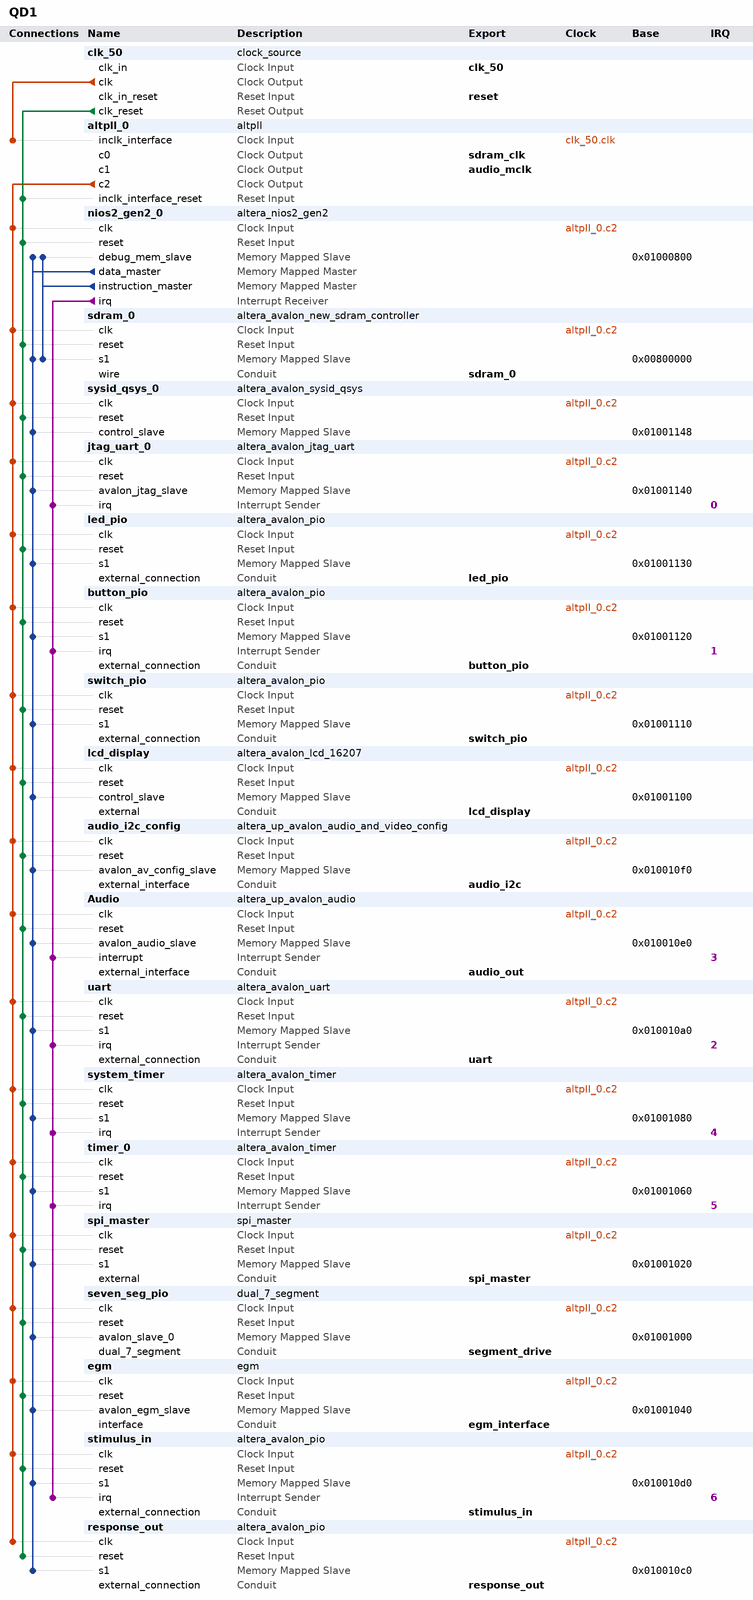
[diagram p0: system contents]
# Platform Designer (Qsys) system QD1, MAX 10 10M08SAE144C8G
# Parameters at their usual value, and those the tool derives, are not listed.
package require -exact qsys 15.1
create_system QD1
set_project_property DEVICE_FAMILY {MAX 10}
set_project_property DEVICE 10M08SAE144C8G

add_instance clk_50 clock_source 15.1
set_instance_parameter_value clk_50 clockFrequency 50000000

add_instance altpll_0 altpll 15.1
set_instance_parameter_value altpll_0 CLK0_DIVIDE_BY 1
set_instance_parameter_value altpll_0 CLK0_MULTIPLY_BY 1
set_instance_parameter_value altpll_0 CLK0_PHASE_SHIFT -3000
set_instance_parameter_value altpll_0 CLK1_DIVIDE_BY 1250
set_instance_parameter_value altpll_0 CLK1_DUTY_CYCLE 50
set_instance_parameter_value altpll_0 CLK1_MULTIPLY_BY 307
set_instance_parameter_value altpll_0 CLK1_PHASE_SHIFT 0
set_instance_parameter_value altpll_0 CLK2_DIVIDE_BY 1
set_instance_parameter_value altpll_0 CLK2_DUTY_CYCLE 50
set_instance_parameter_value altpll_0 CLK2_MULTIPLY_BY 1
set_instance_parameter_value altpll_0 CLK2_PHASE_SHIFT 0
set_instance_parameter_value altpll_0 INCLK0_INPUT_FREQUENCY 20000
set_instance_parameter_value altpll_0 PORT_ARESET PORT_USED
set_instance_parameter_value altpll_0 PORT_LOCKED PORT_UNUSED
set_instance_parameter_value altpll_0 PORT_clk1 PORT_USED
set_instance_parameter_value altpll_0 PORT_clk2 PORT_USED
set_instance_parameter_value altpll_0 PORT_clk3 PORT_UNUSED

add_instance nios2_gen2_0 altera_nios2_gen2 15.1
set_instance_parameter_value nios2_gen2_0 dcache_size 2048
set_instance_parameter_value nios2_gen2_0 exceptionSlave sdram_0.s1
set_instance_parameter_value nios2_gen2_0 icache_size 4096
set_instance_parameter_value nios2_gen2_0 impl Fast
set_instance_parameter_value nios2_gen2_0 resetSlave sdram_0.s1

add_instance sdram_0 altera_avalon_new_sdram_controller 15.1
set_instance_parameter_value sdram_0 TAC 5.5
set_instance_parameter_value sdram_0 TRCD 20.0
set_instance_parameter_value sdram_0 TRP 20.0
set_instance_parameter_value sdram_0 casLatency 3
set_instance_parameter_value sdram_0 columnWidth 8
set_instance_parameter_value sdram_0 dataWidth 16
set_instance_parameter_value sdram_0 generateSimulationModel false
set_instance_parameter_value sdram_0 model single_Micron_MT48LC4M32B2_7_chip
set_instance_parameter_value sdram_0 numberOfBanks 4
set_instance_parameter_value sdram_0 numberOfChipSelects 1
set_instance_parameter_value sdram_0 powerUpDelay 100.0
set_instance_parameter_value sdram_0 refreshPeriod 15.625
set_instance_parameter_value sdram_0 rowWidth 12

add_instance sysid_qsys_0 altera_avalon_sysid_qsys 15.1
set_instance_parameter_value sysid_qsys_0 id 0

add_instance jtag_uart_0 altera_avalon_jtag_uart 15.1
set_instance_parameter_value jtag_uart_0 simInteractiveOptions NO_INTERACTIVE_WINDOWS

add_instance led_pio altera_avalon_pio 15.1
set_instance_parameter_value led_pio direction Output
set_instance_parameter_value led_pio width 4

add_instance button_pio altera_avalon_pio 15.1
set_instance_parameter_value button_pio captureEdge true
set_instance_parameter_value button_pio direction Input
set_instance_parameter_value button_pio edgeType ANY
set_instance_parameter_value button_pio generateIRQ true
set_instance_parameter_value button_pio irqType EDGE
set_instance_parameter_value button_pio width 4

add_instance switch_pio altera_avalon_pio 15.1
set_instance_parameter_value switch_pio direction Input
set_instance_parameter_value switch_pio width 8

add_instance lcd_display altera_avalon_lcd_16207 15.1

add_instance audio_i2c_config altera_up_avalon_audio_and_video_config 15.1
set_instance_parameter_value audio_i2c_config audio_in {Line In to ADC}
set_instance_parameter_value audio_i2c_config bit_length 16
set_instance_parameter_value audio_i2c_config board DE1-SoC
set_instance_parameter_value audio_i2c_config line_in_bypass false
set_instance_parameter_value audio_i2c_config sampling_rate {48 kHz}

add_instance Audio altera_up_avalon_audio 15.1
set_instance_parameter_value Audio audio_in true
set_instance_parameter_value Audio avalon_bus_type {Memory Mapped}
set_instance_parameter_value Audio dw 16

add_instance uart altera_avalon_uart 15.1
set_instance_parameter_value uart baud 115200
set_instance_parameter_value uart dataBits 8
set_instance_parameter_value uart fixedBaud true
set_instance_parameter_value uart parity NONE
set_instance_parameter_value uart stopBits 1

add_instance system_timer altera_avalon_timer 15.1
set_instance_parameter_value system_timer period 1
set_instance_parameter_value system_timer periodUnits MSEC

add_instance timer_0 altera_avalon_timer 15.1
set_instance_parameter_value timer_0 period 1
set_instance_parameter_value timer_0 periodUnits MSEC

add_instance spi_master spi_master 1.3

add_instance seven_seg_pio dual_7_segment 1.0

add_instance egm egm 2.0

add_instance stimulus_in altera_avalon_pio 15.1
set_instance_parameter_value stimulus_in captureEdge true
set_instance_parameter_value stimulus_in direction Input
set_instance_parameter_value stimulus_in generateIRQ true
set_instance_parameter_value stimulus_in irqType EDGE
set_instance_parameter_value stimulus_in width 1

add_instance response_out altera_avalon_pio 15.1
set_instance_parameter_value response_out direction Output
set_instance_parameter_value response_out width 1

# connections
add_connection altpll_0.c2 Audio.clk clock
add_connection altpll_0.c2 audio_i2c_config.clk clock
add_connection altpll_0.c2 button_pio.clk clock
add_connection altpll_0.c2 egm.clk clock
add_connection altpll_0.c2 jtag_uart_0.clk clock
add_connection altpll_0.c2 lcd_display.clk clock
add_connection altpll_0.c2 led_pio.clk clock
add_connection altpll_0.c2 nios2_gen2_0.clk clock
add_connection altpll_0.c2 response_out.clk clock
add_connection altpll_0.c2 sdram_0.clk clock
add_connection altpll_0.c2 seven_seg_pio.clk clock
add_connection altpll_0.c2 spi_master.clk clock
add_connection altpll_0.c2 stimulus_in.clk clock
add_connection altpll_0.c2 switch_pio.clk clock
add_connection altpll_0.c2 sysid_qsys_0.clk clock
add_connection altpll_0.c2 system_timer.clk clock
add_connection altpll_0.c2 timer_0.clk clock
add_connection altpll_0.c2 uart.clk clock
add_connection clk_50.clk altpll_0.inclk_interface clock
add_connection clk_50.clk_reset altpll_0.inclk_interface_reset reset
add_connection clk_50.clk_reset Audio.reset reset
add_connection clk_50.clk_reset audio_i2c_config.reset reset
add_connection clk_50.clk_reset button_pio.reset reset
add_connection clk_50.clk_reset egm.reset reset
add_connection clk_50.clk_reset jtag_uart_0.reset reset
add_connection clk_50.clk_reset lcd_display.reset reset
add_connection clk_50.clk_reset led_pio.reset reset
add_connection clk_50.clk_reset nios2_gen2_0.reset reset
add_connection clk_50.clk_reset response_out.reset reset
add_connection clk_50.clk_reset sdram_0.reset reset
add_connection clk_50.clk_reset seven_seg_pio.reset reset
add_connection clk_50.clk_reset spi_master.reset reset
add_connection clk_50.clk_reset stimulus_in.reset reset
add_connection clk_50.clk_reset switch_pio.reset reset
add_connection clk_50.clk_reset sysid_qsys_0.reset reset
add_connection clk_50.clk_reset system_timer.reset reset
add_connection clk_50.clk_reset timer_0.reset reset
add_connection clk_50.clk_reset uart.reset reset
add_connection nios2_gen2_0.data_master Audio.avalon_audio_slave avalon
set_connection_parameter_value nios2_gen2_0.data_master/Audio.avalon_audio_slave baseAddress 0x010010e0
add_connection nios2_gen2_0.data_master audio_i2c_config.avalon_av_config_slave avalon
set_connection_parameter_value nios2_gen2_0.data_master/audio_i2c_config.avalon_av_config_slave baseAddress 0x010010f0
add_connection nios2_gen2_0.data_master button_pio.s1 avalon
set_connection_parameter_value nios2_gen2_0.data_master/button_pio.s1 baseAddress 0x01001120
add_connection nios2_gen2_0.data_master egm.avalon_egm_slave avalon
set_connection_parameter_value nios2_gen2_0.data_master/egm.avalon_egm_slave baseAddress 0x01001040
add_connection nios2_gen2_0.data_master jtag_uart_0.avalon_jtag_slave avalon
set_connection_parameter_value nios2_gen2_0.data_master/jtag_uart_0.avalon_jtag_slave baseAddress 0x01001140
add_connection nios2_gen2_0.data_master lcd_display.control_slave avalon
set_connection_parameter_value nios2_gen2_0.data_master/lcd_display.control_slave baseAddress 0x01001100
add_connection nios2_gen2_0.data_master led_pio.s1 avalon
set_connection_parameter_value nios2_gen2_0.data_master/led_pio.s1 baseAddress 0x01001130
add_connection nios2_gen2_0.data_master nios2_gen2_0.debug_mem_slave avalon
set_connection_parameter_value nios2_gen2_0.data_master/nios2_gen2_0.debug_mem_slave baseAddress 0x01000800
add_connection nios2_gen2_0.data_master response_out.s1 avalon
set_connection_parameter_value nios2_gen2_0.data_master/response_out.s1 baseAddress 0x010010c0
add_connection nios2_gen2_0.data_master sdram_0.s1 avalon
set_connection_parameter_value nios2_gen2_0.data_master/sdram_0.s1 baseAddress 0x00800000
add_connection nios2_gen2_0.data_master seven_seg_pio.avalon_slave_0 avalon
set_connection_parameter_value nios2_gen2_0.data_master/seven_seg_pio.avalon_slave_0 baseAddress 0x01001000
add_connection nios2_gen2_0.data_master spi_master.s1 avalon
set_connection_parameter_value nios2_gen2_0.data_master/spi_master.s1 baseAddress 0x01001020
add_connection nios2_gen2_0.data_master stimulus_in.s1 avalon
set_connection_parameter_value nios2_gen2_0.data_master/stimulus_in.s1 baseAddress 0x010010d0
add_connection nios2_gen2_0.data_master switch_pio.s1 avalon
set_connection_parameter_value nios2_gen2_0.data_master/switch_pio.s1 baseAddress 0x01001110
add_connection nios2_gen2_0.data_master sysid_qsys_0.control_slave avalon
set_connection_parameter_value nios2_gen2_0.data_master/sysid_qsys_0.control_slave baseAddress 0x01001148
add_connection nios2_gen2_0.data_master system_timer.s1 avalon
set_connection_parameter_value nios2_gen2_0.data_master/system_timer.s1 baseAddress 0x01001080
add_connection nios2_gen2_0.data_master timer_0.s1 avalon
set_connection_parameter_value nios2_gen2_0.data_master/timer_0.s1 baseAddress 0x01001060
add_connection nios2_gen2_0.data_master uart.s1 avalon
set_connection_parameter_value nios2_gen2_0.data_master/uart.s1 baseAddress 0x010010a0
add_connection nios2_gen2_0.instruction_master nios2_gen2_0.debug_mem_slave avalon
set_connection_parameter_value nios2_gen2_0.instruction_master/nios2_gen2_0.debug_mem_slave baseAddress 0x01000800
add_connection nios2_gen2_0.instruction_master sdram_0.s1 avalon
set_connection_parameter_value nios2_gen2_0.instruction_master/sdram_0.s1 baseAddress 0x00800000
add_connection nios2_gen2_0.irq Audio.interrupt interrupt
set_connection_parameter_value nios2_gen2_0.irq/Audio.interrupt irqNumber 3
add_connection nios2_gen2_0.irq button_pio.irq interrupt
set_connection_parameter_value nios2_gen2_0.irq/button_pio.irq irqNumber 1
add_connection nios2_gen2_0.irq jtag_uart_0.irq interrupt
set_connection_parameter_value nios2_gen2_0.irq/jtag_uart_0.irq irqNumber 0
add_connection nios2_gen2_0.irq stimulus_in.irq interrupt
set_connection_parameter_value nios2_gen2_0.irq/stimulus_in.irq irqNumber 6
add_connection nios2_gen2_0.irq system_timer.irq interrupt
set_connection_parameter_value nios2_gen2_0.irq/system_timer.irq irqNumber 4
add_connection nios2_gen2_0.irq timer_0.irq interrupt
set_connection_parameter_value nios2_gen2_0.irq/timer_0.irq irqNumber 5
add_connection nios2_gen2_0.irq uart.irq interrupt
set_connection_parameter_value nios2_gen2_0.irq/uart.irq irqNumber 2

# exported interfaces
add_interface audio_i2c conduit end
set_interface_property audio_i2c EXPORT_OF audio_i2c_config.external_interface
add_interface audio_mclk clock source
set_interface_property audio_mclk EXPORT_OF altpll_0.c1
add_interface audio_out conduit end
set_interface_property audio_out EXPORT_OF Audio.external_interface
add_interface button_pio conduit end
set_interface_property button_pio EXPORT_OF button_pio.external_connection
add_interface clk_50 clock sink
set_interface_property clk_50 EXPORT_OF clk_50.clk_in
add_interface egm_interface conduit end
set_interface_property egm_interface EXPORT_OF egm.interface
add_interface lcd_display conduit end
set_interface_property lcd_display EXPORT_OF lcd_display.external
add_interface led_pio conduit end
set_interface_property led_pio EXPORT_OF led_pio.external_connection
add_interface reset reset sink
set_interface_property reset EXPORT_OF clk_50.clk_in_reset
add_interface response_out conduit end
set_interface_property response_out EXPORT_OF response_out.external_connection
add_interface sdram_0 conduit end
set_interface_property sdram_0 EXPORT_OF sdram_0.wire
add_interface sdram_clk clock source
set_interface_property sdram_clk EXPORT_OF altpll_0.c0
add_interface segment_drive conduit end
set_interface_property segment_drive EXPORT_OF seven_seg_pio.dual_7_segment
add_interface spi_master conduit end
set_interface_property spi_master EXPORT_OF spi_master.external
add_interface stimulus_in conduit end
set_interface_property stimulus_in EXPORT_OF stimulus_in.external_connection
add_interface switch_pio conduit end
set_interface_property switch_pio EXPORT_OF switch_pio.external_connection
add_interface uart conduit end
set_interface_property uart EXPORT_OF uart.external_connection

set_interconnect_requirement {$system} qsys_mm.clockCrossingAdapter HANDSHAKE
set_interconnect_requirement {$system} qsys_mm.enableEccProtection FALSE
set_interconnect_requirement {$system} qsys_mm.insertDefaultSlave FALSE
set_interconnect_requirement {$system} qsys_mm.maxAdditionalLatency 1

save_system QD1.qsys
